# EAGLE design battery_board (EAGLE 9.6.2)
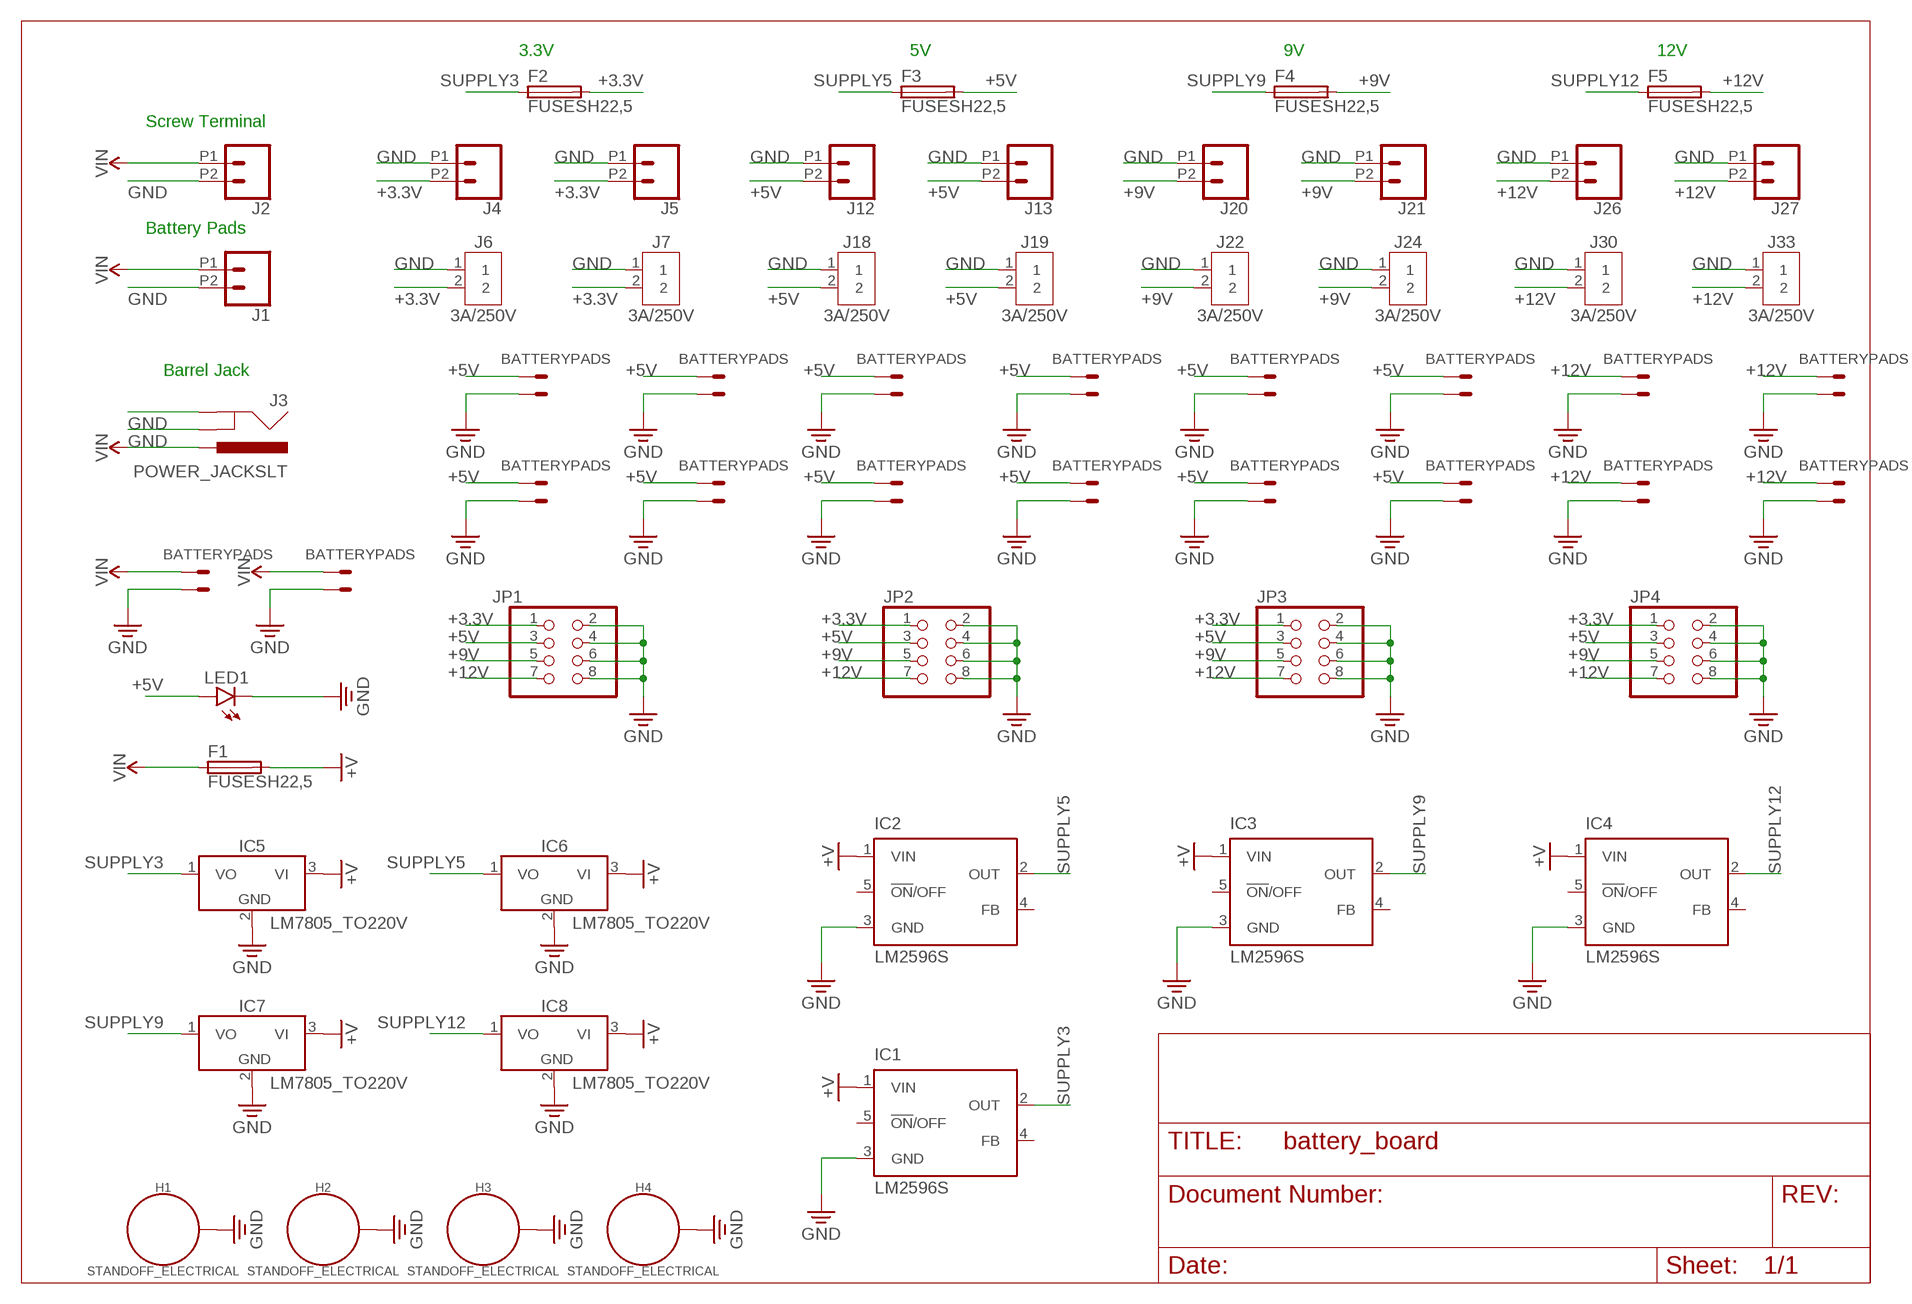
[diagram p0: schematic, sheet 1]

## Parts
BATTERY1  BATTERYPADS  [DIODFN1228X508X30-2N]
BATTERY2  BATTERYPADS  [DIODFN1228X508X30-2N]
F1  FUSESH22,5  [SH22,5]
F2  FUSESH22,5  [SH22,5]
F3  FUSESH22,5  [SH22,5]
F4  FUSESH22,5  [SH22,5]
F5  FUSESH22,5  [SH22,5]
H1  STANDOFF_ELECTRICAL  [STANDOFF-ELECTRICAL]
H2  STANDOFF_ELECTRICAL  [STANDOFF-ELECTRICAL]
H3  STANDOFF_ELECTRICAL  [STANDOFF-ELECTRICAL]
H4  STANDOFF_ELECTRICAL  [STANDOFF-ELECTRICAL]
IC1  LM2596S  [TO263-5]
IC2  LM2596S  [TO263-5]
IC3  LM2596S  [TO263-5]
IC4  LM2596S  [TO263-5]
IC5  LM7805_TO220V  [TO220V]
IC6  LM7805_TO220V  [TO220V]
IC7  LM7805_TO220V  [TO220V]
IC8  LM7805_TO220V  [TO220V]
J1  CONN_022.54MM_SCREWTERM  [1X02_2.54_SCREWTERM]
J2  CONN_022.54MM_SCREWTERM  [1X02_2.54_SCREWTERM]
J3  POWER_JACKSLT  [POWER_JACK_SLOT]
J4  CONN_022.54MM_SCREWTERM  [1X02_2.54_SCREWTERM]
J5  CONN_022.54MM_SCREWTERM  [1X02_2.54_SCREWTERM]
J6  3A/250V  B2B-XH-A  [B2B-XH-A]
J7  3A/250V  B2B-XH-A  [B2B-XH-A]
J12  CONN_022.54MM_SCREWTERM  [1X02_2.54_SCREWTERM]
J13  CONN_022.54MM_SCREWTERM  [1X02_2.54_SCREWTERM]
J18  3A/250V  B2B-XH-A  [B2B-XH-A]
J19  3A/250V  B2B-XH-A  [B2B-XH-A]
J20  CONN_022.54MM_SCREWTERM  [1X02_2.54_SCREWTERM]
J21  CONN_022.54MM_SCREWTERM  [1X02_2.54_SCREWTERM]
J22  3A/250V  B2B-XH-A  [B2B-XH-A]
J24  3A/250V  B2B-XH-A  [B2B-XH-A]
J26  CONN_022.54MM_SCREWTERM  [1X02_2.54_SCREWTERM]
J27  CONN_022.54MM_SCREWTERM  [1X02_2.54_SCREWTERM]
J30  3A/250V  B2B-XH-A  [B2B-XH-A]
J33  3A/250V  B2B-XH-A  [B2B-XH-A]
JP1  PINHD-2X4  [2X04]
JP2  PINHD-2X4  [2X04]
JP3  PINHD-2X4  [2X04]
JP4  PINHD-2X4  [2X04]
LED1  LEDCHIP-LED0805  [CHIP-LED0805]
U$1  BATTERYPADS  [DIODFN1228X508X30-2N]
U$2  BATTERYPADS  [DIODFN1228X508X30-2N]
U$3  BATTERYPADS  [DIODFN1228X508X30-2N]
U$4  BATTERYPADS  [DIODFN1228X508X30-2N]
U$5  BATTERYPADS  [DIODFN1228X508X30-2N]
U$6  BATTERYPADS  [DIODFN1228X508X30-2N]
U$7  BATTERYPADS  [DIODFN1228X508X30-2N]
U$8  BATTERYPADS  [DIODFN1228X508X30-2N]
U$9  BATTERYPADS  [DIODFN1228X508X30-2N]
U$10  BATTERYPADS  [DIODFN1228X508X30-2N]
U$11  BATTERYPADS  [DIODFN1228X508X30-2N]
U$12  BATTERYPADS  [DIODFN1228X508X30-2N]
U$13  BATTERYPADS  [DIODFN1228X508X30-2N]
U$14  BATTERYPADS  [DIODFN1228X508X30-2N]
U$15  BATTERYPADS  [DIODFN1228X508X30-2N]
U$16  BATTERYPADS  [DIODFN1228X508X30-2N]

## Nets
+3.3V: F2.2 J4.P2 J5.P2 J6.2 J7.2 JP1.1 JP2.1 JP3.1 JP4.1
+5V: F3.2 J12.P2 J13.P2 J18.2 J19.2 JP1.3 JP2.3 JP3.3 JP4.3 LED1.A U$1.VIN U$2.VIN U$3.VIN U$4.VIN U$5.VIN U$6.VIN U$7.VIN U$8.VIN U$13.VIN U$14.VIN U$15.VIN U$16.VIN
+9V: F4.2 J20.P2 J21.P2 J22.2 J24.2 JP1.5 JP2.5 JP3.5 JP4.5
+12V: F5.2 J26.P2 J27.P2 J30.2 J33.2 JP1.7 JP2.7 JP3.7 JP4.7 U$9.VIN U$10.VIN U$11.VIN U$12.VIN
+V: F1.2 IC1.1(VIN) IC2.1(VIN) IC3.1(VIN) IC4.1(VIN) IC5.3(VI) IC6.3(VI) IC7.3(VI) IC8.3(VI)
GND: BATTERY1.GND BATTERY2.GND H1.P1 H2.P1 H3.P1 H4.P1 IC1.3(GND) IC2.3(GND) IC3.3(GND) IC4.3(GND) IC5.2(GND) IC6.2(GND) IC7.2(GND) IC8.2(GND) J1.P2 J2.P2 J3.GND@1(GNDBREAK) J3.GND@2(GND) J4.P1 J5.P1 J6.1 J7.1 J12.P1 J13.P1 J18.1 J19.1 J20.P1 J21.P1 J22.1 J24.1 J26.P1 J27.P1 J30.1 J33.1 JP1.2 JP1.4 JP1.6 JP1.8 JP2.2 JP2.4 JP2.6 JP2.8 JP3.2 JP3.4 JP3.6 JP3.8 JP4.2 JP4.4 JP4.6 JP4.8 LED1.C U$1.GND U$2.GND U$3.GND U$4.GND U$5.GND U$6.GND U$7.GND U$8.GND U$9.GND U$10.GND U$11.GND U$12.GND U$13.GND U$14.GND U$15.GND U$16.GND
SUPPLY3: F2.1 IC1.2(OUT) IC5.1(VO)
SUPPLY5: F3.1 IC2.2(OUT) IC6.1(VO)
SUPPLY9: F4.1 IC3.2(OUT) IC7.1(VO)
SUPPLY12: F5.1 IC4.2(OUT) IC8.1(VO)
VIN: BATTERY1.VIN BATTERY2.VIN F1.1 J1.P1 J2.P1 J3.PWR
Unconnected: IC1.4(FB) IC1.5(!ON!/OFF) IC2.4(FB) IC2.5(!ON!/OFF) IC3.4(FB) IC3.5(!ON!/OFF) IC4.4(FB) IC4.5(!ON!/OFF)

## Notes on the sheet
- 3.3V | 5V | 9V | 12V
- Screw Terminal
- Battery Pads
- Barrel Jack

## Library data of the parts
BATTERY1 BATTERY2 U$1-U$16 = Quynn:BATTERYPADS
F1-F5 = fuse:FUSE: Fuse; OC_FARNELL: unknown; OC_NEWARK: unknown
H1-H4 = SparkFun-Hardware:STANDOFF_ELECTRICAL: Stand Off Drill holes with an electrical connection. For example, use these to ground your board to a chassis. Example SparkFun Products Screw - Phillips Head (1/4", 4-40, 10 pack) <https://www.sparkfun.com/products/10453> (PRT-10453) Screw - Phillips Head (1/2", 4-40, 10 pack) <https://www.sparkfun.com/products/10452> (PRT-10452) Screw - Phillips Head (3/4", 4-40, 10 pack) <https://www.sparkfun.com/products/10451> (PRT-10451) Screw - Phillips Head (1", 4-40, 10 pack) <https://www.sparkfun.com/products/10450> (PRT-10450)
IC1-IC4 = national-semiconductor:LM2596: SIMPLE SWITCHER® Power Converter 150 kHz 3A Step-Down Voltage Regulator Source: http://www.national.com/ds/LM/LM2596.pdf; MF: NATIONAL SEMICONDUCTOR; MPN: LM2596S-ADJ/NOPB; OC_FARNELL: 9494367; OC_NEWARK: 41K3842
IC5-IC8 = IC_Power-Management:LM7805: 5V Voltage Regulator Reference Datasheet <https://www.ti.com/lit/ds/symlink/lm340.pdf>; CATEGORY: IC_Linear; DESCRIPTION: 5V Voltage Regulator; MANUFACTURER: Generic; MPN: Generic; SERIES: LM7805; SUB-CATEGORY: Voltage Regulator; TYPE: 5V
J1 J2 J4 J5 J12 J13 J20 J21 J26 J27 = SparkFun-Connectors:CONN_02: Multi connection point. Often used as Generic Header-pin footprint for 0.1 inch spaced/style header connections On any of the 0.1 inch spaced packages, you can populate with these: Break Away Headers - Straight <https://www.sparkfun.com/products/116> (PRT-00116) Break Away Male Headers - Right Angle <https://www.sparkfun.com/products/553> (PRT-00553) Female Headers <https://www.sparkfun.com/products/115> (PRT-00115) Break Away Headers - Machine Pin <https://www.sparkfun.com/products/117> (PRT-00117) Break Away Female Headers - Swiss Machine Pin <https://www.sparkfun.com/products/743> (PRT-00743) For SCREWTERMINALS and SPRING TERMINALS visit here: Screw Terimnals on SparkFun.com <https://www.sparkfun.com/search/results?term=Screw+Terminals> (5mm/3.5mm/2.54mm spacing) This device is also useful as a general connection point to wire up your design to another part of your project. Our various solder wires solder well into these plated through hole pads. Hook-Up Wire - Assortment (Stranded, 22 AWG) <https://www.sparkfun.com/products/11375> (PRT-11375) Hook-Up Wire - Assortment (Solid Core, 22 AWG) <https://www.sparkfun.com/products/11367> (PRT-11367) View the entire wire category on our website here <https://www.sparkfun.com/categories/141> Special notes: Molex polarized connector foot print use with: PRT-08233 with associated crimp pins and housings. 2.54_SCREWTERM for use with PRT-10571. 3.5mm Screw Terminal footprints for PRT-08084 5mm Screw Terminal footprints for use with PRT-08432
J3 = SparkFun-Connectors:POWER_JACK: Power Jack Connector This is the standard 5.5mm barrel jack for power. The PTH is the most common, proven, reliable, footprint. The Slot footprint only works if the mill layer is transmitted to the PCB fab house so be warned. Here are the connectors we sell at SparkFun: DC Barrel Power Jack/Connector <https://www.sparkfun.com/products/119> (PRT-00119) DC Barrel Power Jack/Connector (SMD) <https://www.sparkfun.com/products/12748> (PRT-12748) DC Barrel Jack Adapter - Breadboard Compatible <https://www.sparkfun.com/products/10811> (PRT-10811) It is used on this SparkFun product (and many, many others): SparkFun RedBoard - Programmed with Arduino <https://www.sparkfun.com/products/12757> (DEV-12757) Also, if you need a mating power supply or connector, please check these out: Wall Adapter Power Supply - 9VDC 650mA <https://www.sparkfun.com/products/298> (TOL-00298) DC Barrel Jack Adapter - Male <https://www.sparkfun.com/products/10287> (PRT-10287); PROD_ID: PRT-00119
J6 J7 J18 J19 J22 J24 J30 J33 = Connector:B2B-XH-A: XH Connector Top Entry - 2POS Details see: Datasheet <http://www.jst-mfg.com/product/pdf/eng/eXH.pdf>; CATEGORY: CONNECTOR; DESCRIPTION: 2.5mm pitch/disconnectable crimp style connector; MANUFACTURER: JST (XH CONNECTOR); MPN: B2B-XH-A; OPERATING_TEMPERATURE: -25°C ~ 85°C; PART_STATUS: ACTIVE; ROHS_COMPLIANT: COMPLIANT; SERIES: B_B-XH-A; SUB_CATEGORY: Through hole connector; TYPE: top entry
JP1-JP4 = adafruit:PINHD-2X4: PIN HEADER
LED1 = led:LED: LED OSRAM: - CHIPLED LG R971, LG N971, LY N971, LG Q971, LY Q971, LO R971, LY R971 LH N974, LH R974 LS Q976, LO Q976, LY Q976 LO Q996 - Hyper CHIPLED LW Q18S LB Q993, LB Q99A, LB R99A - SideLED LS A670, LO A670, LY A670, LG A670, LP A670 LB A673, LV A673, LT A673, LW A673 LH A674 LY A675 LS A676, LA A676, LO A676, LY A676, LW A676 LS A679, LY A679, LG A679 - Hyper Micro SIDELED® LS Y876, LA Y876, LO Y876, LY Y876 LT Y87S - SmartLED LW L88C, LW L88S LB L89C, LB L89S, LG L890 LS L89K, LO L89K, LY L89K LS L896, LA L896, LO L896, LY L896 - TOPLED LS T670, LO T670, LY T670, LG T670, LP T670 LSG T670, LSP T670, LSY T670, LOP T670, LYG T670 LG T671, LOG T671, LSG T671 LB T673, LV T673, LT T673, LW T673 LH T674 LS T676, LA T676, LO T676, LY T676, LB T676, LH T676, LSB T676, LW T676 LB T67C, LV T67C, LT T67C, LS T67K, LO T67K, LY T67K, LW E67C LS E67B, LA E67B, LO E67B, LY E67B, LB E67C, LV E67C, LT E67C LW T67C LS T679, LY T679, LG T679 LS T770, LO T770, LY T770, LG T770, LP T770 LB T773, LV T773, LT T773, LW T773 LH T774 LS E675, LA E675, LY E675, LS T675 LS T776, LA T776, LO T776, LY T776, LB T776 LHGB T686 LT T68C, LB T68C - Hyper Mini TOPLED® LB M676 - Mini TOPLED Santana® LG M470 LS M47K, LO M47K, LY M47K Source: http://www.osram.convergy.de LUXEON: - LUMILED® LXK2-PW12-R00, LXK2-PW12-S00, LXK2-PW14-U00, LXK2-PW14-V00 LXK2-PM12-R00, LXK2-PM12-S00, LXK2-PM14-U00 LXK2-PE12-Q00, LXK2-PE12-R00, LXK2-PE12-S00, LXK2-PE14-T00, LXK2-PE14-U00 LXK2-PB12-K00, LXK2-PB12-L00, LXK2-PB12-M00, LXK2-PB14-N00, LXK2-PB14-P00, LXK2-PB14-Q00 LXK2-PR12-L00, LXK2-PR12-M00, LXK2-PR14-Q00, LXK2-PR14-R00 LXK2-PD12-Q00, LXK2-PD12-R00, LXK2-PD12-S00 LXK2-PH12-R00, LXK2-PH12-S00 LXK2-PL12-P00, LXK2-PL12-Q00, LXK2-PL12-R00 Source: www.luxeon.com KINGBRIGHT: KA-3528ASYC Source: www.kingbright.com

## Board
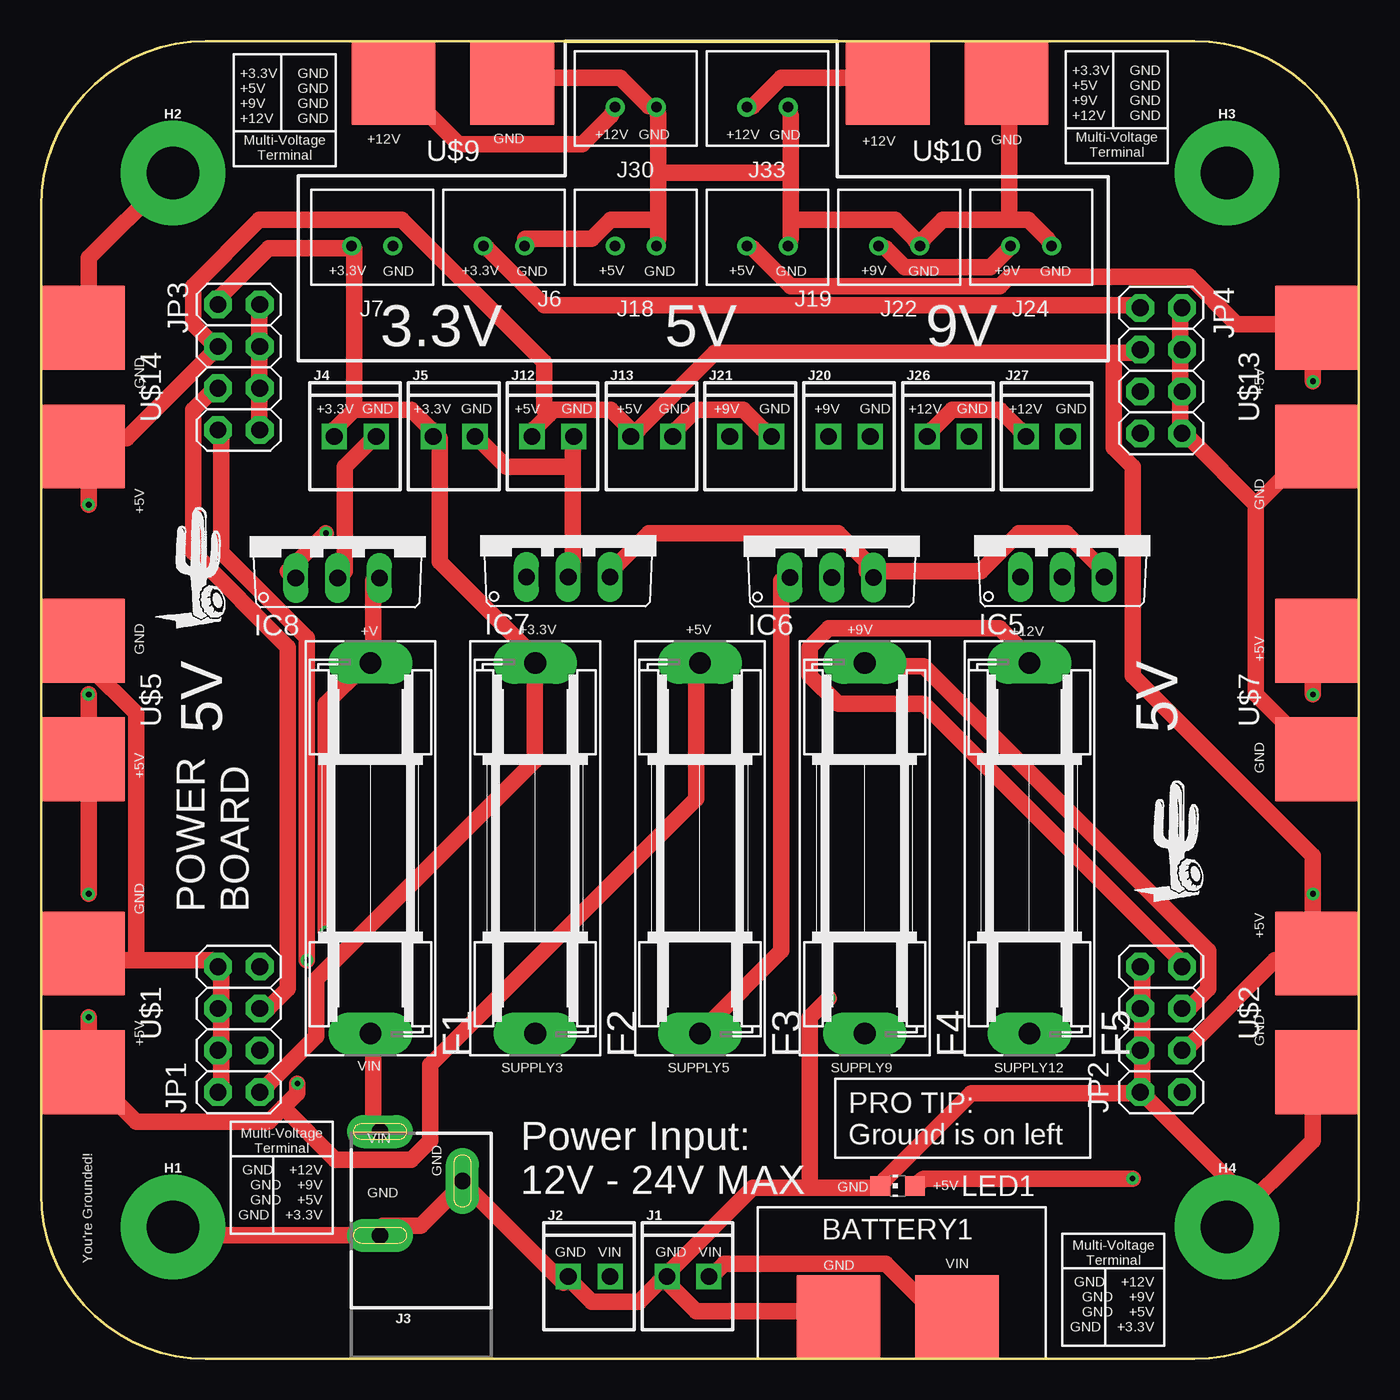
[diagram p1: board, top side]
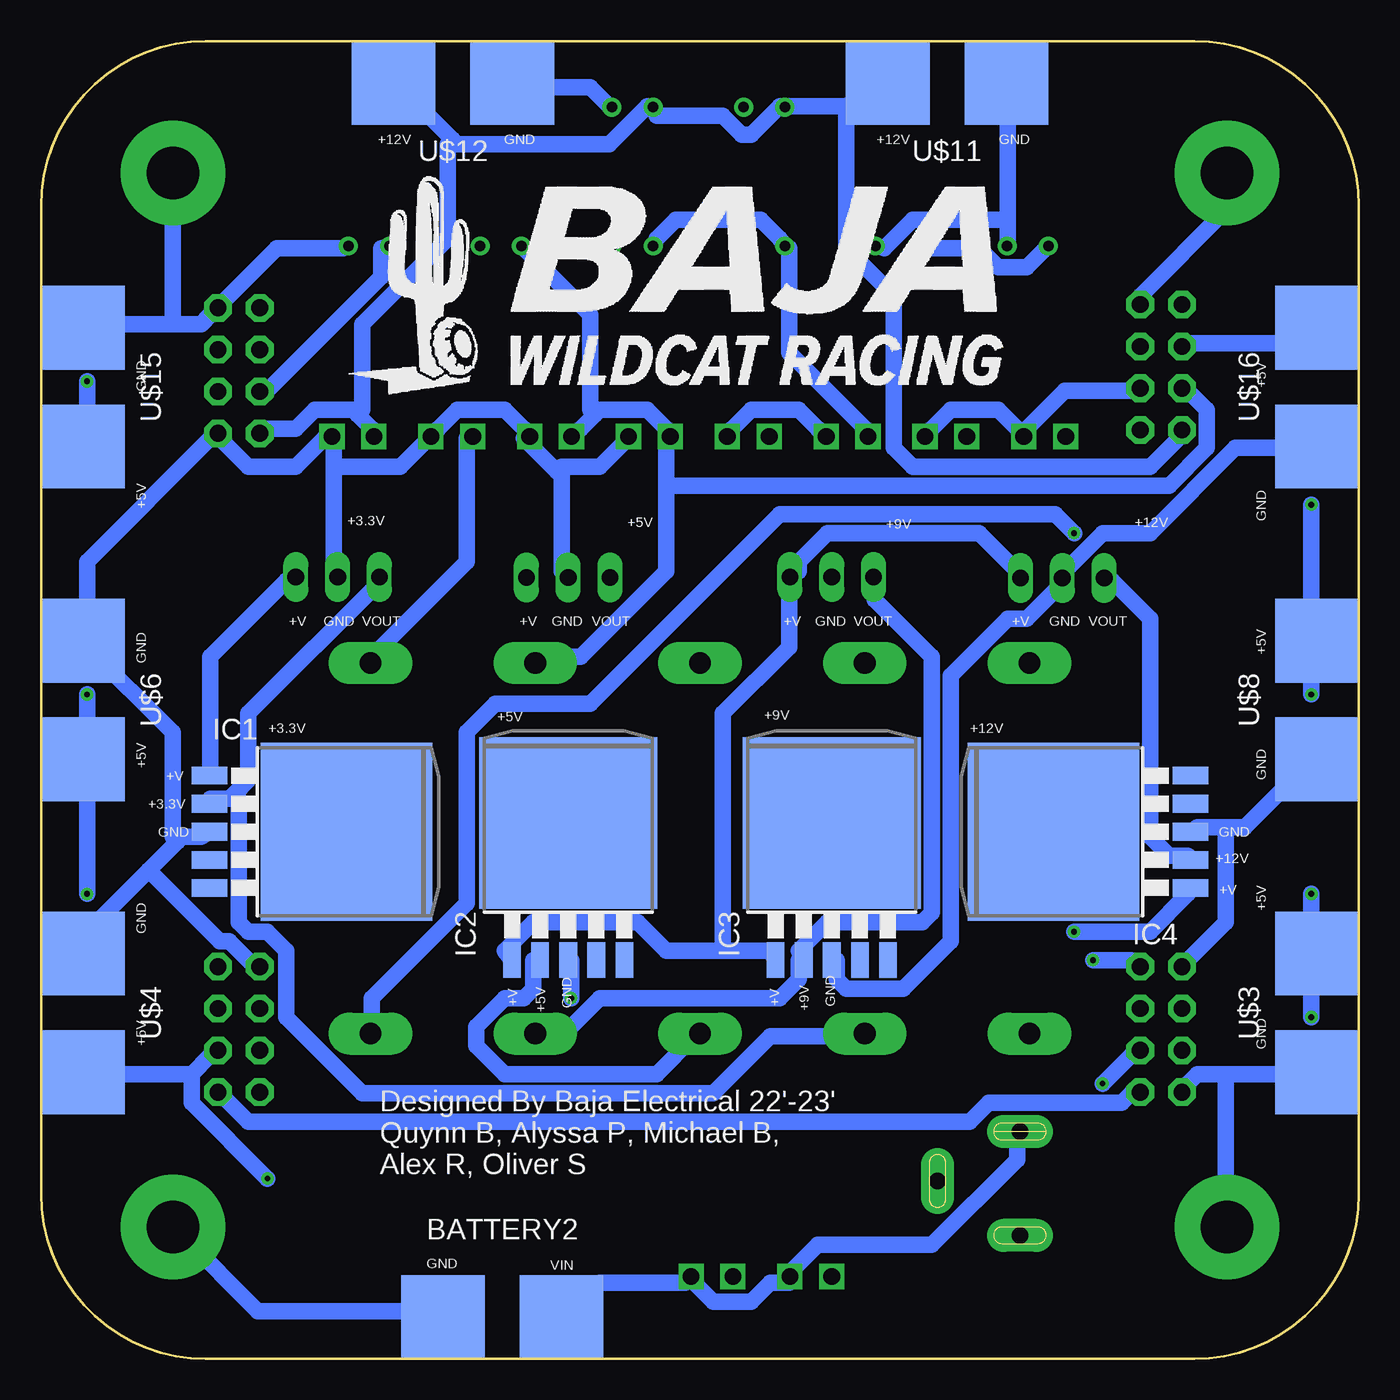
[diagram p2: board, bottom side, seen from below]

Size 80 x 80 mm. Coordinates in mm from the lower left corner, seen from the top.
Outline: 10,0 arc-90 0,10 0,70 arc-90 10,80 70,80 arc-90 80,70 80,10 arc-90 70,0 10,0
Copper layers (1*16): Top 0.035mm / dielectric 1.5mm / Bottom 0.035mm
Design rules "default *": minimum track width 1mm, minimum drill 0.35mm, track to track 6mil, track to pad 6mil, pad to pad 6mil, via to via 6mil, smd to smd 6mil, copper to edge 40mil, drill to drill 6mil, minimum pad ring 10mil, minimum via ring 8mil, stop-mask expansion 4mil, vias tented up to drill 0mil, thermal gap 10mil

### Footprints (pad centres in the part's own frame; a part is rotated, then mirrored left to right if it is on the bottom)
DIODFN1228X508X30-2N = smd 5.08 x 5.08: GND -3.6,2.54; VIN 3.6,2.54
SH22,5 = drill 1.321 pad 2.54 long: 1 -11.252,0; 2 11.252,0
STANDOFF-ELECTRICAL = drill 3.2 pad 6.35: P1 0,0
TO263-5 = smd 1.067 x 2.159: 1 -3.404,-5.791; 2 -1.702,-5.791; 3 0,-5.791; 4 1.702,-5.791; 5 3.404,-5.791 | smd 10.8 x 10.41: 6 0,2.54
TO220V = drill 1.016 long: 1 -2.54,-2.54; 2 0,-2.54; 3 2.54,-2.54
1X02_2.54_SCREWTERM = drill 1.016 square: P1 2.54,0; P2 0,0
POWER_JACK_SLOT = drill 1 pad 2 long: GND@1 2.58,7.5; GND@2 7.58,10.8; PWR 2.58,13.8
B2B-XH-A = drill 0.64: 1 0,0; 2 2.5,0
2X04 = drill 1.016 pad 1.676 octagon: 1 -3.81,-1.27; 2 -3.81,1.27; 3 -1.27,-1.27; 4 -1.27,1.27; 5 1.27,-1.27; 6 1.27,1.27; 7 3.81,-1.27; 8 3.81,1.27
CHIP-LED0805 = smd 1.2 x 1.2: A 0,-1.05; C 0,1.05

### Placement (x,y rotation side)
BATTERY1  52,0 0 top
BATTERY2  52,0 0 bottom
F1  20,31 90 top
F2  30,31 90 top
F3  40,31 90 top
F4  50,31 90 top
F5  60,31 90 top
H1  8,8 0 top
H2  8,72 0 top
H3  72,72 0 top
H4  72,8 0 top
IC1  64,32 270 bottom
IC2  48,30 0 bottom
IC3  32,30 0 bottom
IC4  16,32 90 bottom
IC5  62,50 0 top
IC6  48,49.98 0 top
IC7  32,50 0 top
IC8  18,49.95 0 top
J1  38,5 0 top
J2  32,5 0 top
J3  18,0 0 top
J4  17.8,56 0 top
J5  23.8,56 0 top
J6  29.35,67.56 180 top
J7  21.35,67.56 180 top
J12  29.8,56 0 top
J13  35.8,56 0 top
J18  37.35,67.56 180 top
J19  45.35,67.56 180 top
J20  47.8,56 0 top
J21  41.8,56 0 top
J22  53.35,67.56 180 top
J24  61.35,67.56 180 top
J26  53.8,56 0 top
J27  59.8,56 0 top
J30  37.35,76 180 top
J33  45.35,76 180 top
JP1  12,20 90 top
JP2  68,20 90 top
JP3  12,60.2 270 top
JP4  68,60 270 top
LED1  52,10.5 90 top
U$1  0,21 270 top
U$2  80,21 90 top
U$3  0,21 90 bottom
U$4  80,21 270 bottom
U$5  0,40 270 top
U$6  80,40 270 bottom
U$7  80,40 90 top
U$8  0,40 90 bottom
U$9  25,80 180 top
U$10  55,80 180 top
U$11  25,80 180 bottom
U$12  55,80 180 bottom
U$13  80,59 90 top
U$14  0,59 270 top
U$15  80,59 270 bottom
U$16  0,59 90 bottom

### Tracks (layer width: path | path; a pad name or v marks a point on that pad's centre or on a via)
+3.3V
  Top 1: 19.02,57.62 17.86,56.47 J4.P2 | 19.02,57.62 22.47,57.62 23.62,56.47 J5.P2 24.2,55.89 24.2,48.4 29.96,42.64 F2.2 29.96,42.06 29.96,36.3 16.71,23.05 16.71,19.59 13.83,16.71 JP1.1 | JP3.1 10.95,64.53 13.83,67.42 18.44,67.42 J7.2 19.02,67.42 19.02,57.62 | JP4.1 66.26,63.96 30.54,63.96 27.08,67.42 J6.2
  Bottom 1: J6.2 26.5,67.42 23.05,67.42 21.9,66.26 20.17,66.26 19.02,67.42 J7.2 | JP2.1 69.14,16.13 67.42,14.4 23.62,14.4 22.47,15.56 14.4,15.56 13.83,16.13 JP1.1
+5V  (via drill 0.35)
  Top 1: v2.88,40.33 2.88,36.88 U$5.VIN 2.88,36.3 v2.88,28.23 | v15.56,16.71 15.56,16.13 14.69,15.27 | 14.69,15.27 13.83,14.4 5.76,14.4 2.88,17.29 U$1.VIN 2.88,17.86 v2.88,20.74 | 14.69,15.27 17.86,12.1 22.47,12.1 23.62,13.25 23.62,17.86 39.76,34 39.76,42.06 F3.2 | v77.21,40.33 77.21,43.22 U$7.VIN | v66.26,10.95 53.59,10.95 LED1.A | JP2.3 69.72,19.02 74.91,24.2 77.21,24.2 U$2.VIN 77.21,24.78 v77.21,28.23 77.21,30.54 66.26,41.49 66.26,54.16 65.11,55.31 65.11,61.08 | v77.21,59.35 77.21,62.23 U$13.VIN 77.21,62.81 72.6,62.81 69.72,65.69 58.77,65.69 58.2,65.11 45.52,65.11 43.22,67.42 J19.2 | 30.83,57.33 31.11,57.62 34.57,57.62 35.72,56.47 J13.P2 36.3,56.47 40.91,61.08 65.11,61.08 | 30.83,57.33 29.96,56.47 J12.P2 | 65.11,61.08 66.26,61.08 JP4.3 | 30.83,57.33 30.54,57.62 30.54,60.5 21.9,69.14 13.25,69.14 9.22,65.11 9.22,62.81 10.37,61.65 JP3.3 10.37,61.08 5.19,55.89 2.88,55.89 U$14.VIN 2.88,55.31 v2.88,51.86
  Bottom 1: v2.88,40.33 2.88,43.22 U$8.VIN 2.88,43.79 v2.88,51.86 | v15.56,16.71 13.83,18.44 JP1.3 | v2.88,20.74 2.88,24.2 U$3.VIN 2.88,24.78 v2.88,28.23 | v77.21,40.33 77.21,36.88 U$6.VIN 77.21,36.3 v77.21,28.23 | v66.26,10.95 70.87,15.56 70.87,17.29 | 70.87,17.29 69.72,18.44 JP2.3 | 70.87,17.29 77.21,17.29 U$4.VIN | JP3.3 10.37,61.65 3.46,61.65 2.88,62.23 U$16.VIN | v77.21,59.35 77.21,55.89 U$15.VIN | J19.2 42.64,67.99 41.49,69.14 36.3,69.14 35.15,67.99 J18.2 34.57,67.42 34.57,61.08 29.96,56.47 J12.P2
+9V
  Top 1: JP1.5 13.83,21.32 14.98,22.47 14.98,43.22 9.22,48.98 9.22,57.62 10.37,58.77 JP3.5 | J22.2 51.28,67.42 52.43,66.26 57.62,66.26 58.77,67.42 J24.2 | JP2.5 69.72,21.32 70.87,22.47 70.87,24.78 53.59,42.06 50.13,42.06 F4.2
  Bottom 1: 46.38,57.33 47.25,56.47 J20.P2 | 46.38,57.33 46.1,57.62 43.22,57.62 42.06,56.47 J21.P2 42.06,55.89 42.06,53.01 | JP4.5 66.26,58.77 59.35,65.69 59.35,67.42 J24.2 | 46.38,57.33 46.67,57.62 46.67,63.38 50.71,67.42 J22.2 | 42.06,53.01 42.06,47.83 47.25,42.64 49.55,42.64 F4.2 | 42.06,53.01 11.52,53.01 9.22,55.31 9.22,57.62 10.37,58.77 JP3.5
+12V  (via drill 0.35)
  Top 1: J26.P2 54.16,56.47 55.31,57.62 58.2,57.62 59.35,56.47 J27.P2 | JP2.7 69.14,24.2 53.59,39.76 48.4,39.76 46.67,41.49 46.67,43.22 47.83,44.37 58.2,44.37 59.92,42.64 F5.2 | J33.2 43.22,76.06 44.94,77.79 51.28,77.79 U$10.VIN | v16.13,24.2 16.13,43.79 10.95,48.98 10.95,55.89 JP3.7 | U$9.VIN 21.9,77.21 25.35,73.75 32.84,73.75 34.57,75.48 J30.2
  Bottom 1: 60.79,57.33 59.92,56.47 J27.P2 | 60.79,57.33 61.08,57.62 63.38,57.62 64.53,56.47 66.26,56.47 JP4.7 | J26.P2 54.16,55.89 54.16,48.4 59.92,42.64 F5.2 | 55.03,74.04 54.74,73.75 45.52,73.75 43.22,76.06 J33.2 42.64,75.48 38.6,75.48 37.45,74.33 36.88,74.33 35.15,76.06 J30.2 34.57,76.06 31.11,76.06 | 55.03,74.04 58.2,77.21 U$12.VIN | 31.11,76.06 29.96,76.06 28.81,77.21 U$11.VIN 31.11,76.06 | 31.11,76.06 31.11,67.42 28.23,64.53 28.23,55.31 27.08,54.16 12.68,54.16 10.95,55.89 JP3.7 | v16.13,24.2 13.83,24.2 JP1.7 | 60.79,57.33 60.5,57.62 60.5,62.81 55.31,67.99 55.31,73.75 55.03,74.04
+V  (via drill 0.35)
  Top 1: IC5.3 64.53,47.83 62.23,50.13 59.35,50.13 57.04,47.83 50.71,47.83 IC6.3 50.13,47.83 50.13,48.4 48.4,50.13 36.88,50.13 34.57,47.83 IC7.3 | v17.29,25.93 17.29,39.76 19.59,42.06 F1.2 20.17,42.64 20.17,47.25 IC8.3
  Bottom 1: IC1.1 69.72,35.72 69.72,42.64 65.11,47.25 IC5.3 | 38.6,24.78 42.06,24.78 43.79,26.5 50.13,26.5 51.86,24.78 IC2.1 | 38.6,24.78 35.72,24.78 IC3.1 | v17.29,25.93 12.68,25.93 10.37,28.23 IC4.1 | IC8.3 20.74,47.83 23.05,50.13 32.27,50.13 34,48.4 34,47.83 IC7.3 34.57,47.25 34.57,43.22 38.6,39.18 38.6,24.78
GND  (via drill 0.35)
  Top 1: U$14.GND 2.88,62.81 2.88,66.84 7.49,71.45 H2.P1 | JP3.8 13.25,56.47 13.25,58.77 JP3.6 13.25,59.35 13.25,61.08 JP3.4 13.25,61.65 13.25,63.96 JP3.2 | 32.27,54.16 32.27,55.89 J12.P1 | 32.27,54.16 32.27,47.83 IC7.2 | 32.27,54.16 28.23,54.16 26.5,55.89 J5.P1 | J21.P1 43.79,56.47 42.64,57.62 39.76,57.62 38.6,56.47 J13.P1 | IC8.2 18.44,47.83 18.44,54.16 20.17,55.89 J4.P1 | 46.67,10.37 43.22,10.37 38.03,5.19 J1.P2 | 46.67,10.37 50.71,10.37 LED1.C 51.28,10.95 56.47,16.13 66.26,16.13 JP2.2 | v47.83,21.9 46.67,20.74 46.67,10.37 | J1.P2 37.45,4.61 36.3,3.46 33.42,3.46 32.27,4.61 J2.P2 31.69,4.61 25.93,10.37 J3.GND@2 25.35,10.37 23.05,8.07 20.74,8.07 J3.GND@1 20.17,7.49 8.07,7.49 H1.P1 | BATTERY1.GND 47.83,2.88 39.76,2.88 38.03,4.61 J1.P2 | JP1.2 10.95,16.71 10.95,18.44 JP1.4 10.95,19.02 10.95,20.74 JP1.6 10.95,21.32 10.95,23.62 JP1.8 10.37,24.2 5.76,24.2 | 5.76,24.2 2.88,24.2 U$1.GND | 5.76,24.2 5.76,39.18 2.88,42.06 2.88,43.22 U$5.GND | JP2.2 66.84,16.71 66.84,18.44 JP2.4 66.84,19.02 66.84,20.74 JP2.6 66.84,21.32 66.84,23.62 JP2.8 | U$2.GND 77.21,17.29 77.21,13.25 72.03,8.07 H4.P1 73.18,9.79 66.84,16.13 JP2.2 | 45.52,72.03 45.52,75.48 J33.1 | 45.52,72.03 45.52,69.14 | 45.52,69.14 45.52,67.99 J19.1 | 45.52,69.14 51.86,69.14 53.01,67.99 J22.1 53.59,67.99 54.74,69.14 58.77,69.14 | 58.77,69.14 59.92,69.14 61.08,67.99 J24.1 | 58.77,69.14 58.77,77.21 U$10.GND | 37.45,72.03 37.45,75.48 J30.1 36.88,76.06 35.15,77.79 28.81,77.79 U$9.GND | 37.45,72.03 37.45,69.14 | 37.45,69.14 37.45,67.99 J18.1 | 37.45,69.14 34.57,69.14 33.42,67.99 29.39,67.99 J6.1 | 37.45,72.03 45.52,72.03 | JP4.2 69.14,63.38 69.14,61.65 JP4.4 69.14,61.08 69.14,58.77 JP4.6 69.14,58.2 69.14,56.47 JP4.8 69.72,55.89 73.75,51.86
  Top 1: 73.75,51.86 73.75,40.33 77.21,36.88 U$7.GND | 73.75,51.86 77.21,55.31 U$13.GND
  Bottom 1: IC3.3 31.69,24.2 31.69,23.05 31.11,22.47 27.66,22.47 24.78,25.35 24.78,41.49 21.32,44.94 20.17,44.94 17.86,47.25 IC8.2 17.86,47.83 15.56,50.13 12.68,50.13 7.49,55.31 2.88,55.31 U$16.GND | 62.23,54.16 62.23,55.89 J27.P1 62.81,55.89 64.53,54.16 67.42,54.16 69.14,55.89 JP4.8 69.72,55.89 77.21,48.4 77.21,43.79 U$6.GND 77.21,43.22 72.03,38.03 72.03,31.69 71.74,31.4 | 62.23,54.16 62.23,47.83 IC5.2 | 62.23,54.16 58.2,54.16 56.47,55.89 J26.P1 55.89,56.47 54.74,57.62 51.86,57.62 50.71,56.47 J20.P1 50.71,55.89 48.69,53.88 | 48.69,53.88 48.4,53.59 48.4,47.83 IC6.2 | J21.P1 44.37,55.89 46.1,54.16 48.4,54.16 48.69,53.88 | J5.P1 25.93,56.47 24.78,57.62 21.9,57.62 20.74,56.47 J4.P1 20.17,56.47 17.86,58.77 13.83,58.77 JP3.6 | J13.P1 38.03,56.47 36.88,57.62 34,57.62 32.84,56.47 J12.P1 | H2.P1 8.07,71.45 8.07,69.72 13.25,64.53 JP3.2 | v47.83,21.9 47.83,24.2 IC2.3 | 8.07,32.27 6.91,32.27 2.88,36.3 U$8.GND | 8.07,32.27 9.79,32.27 IC4.3 | 8.07,17.29 9.79,17.29 10.37,16.71 JP1.2 | 8.07,17.29 2.88,17.29 U$3.GND | 8.07,32.27 8.07,26.5 10.37,24.2 JP1.8 | 8.07,17.29 8.07,8.07 H1.P1 | 73.47,29.67 77.21,25.93 77.21,24.78 U$4.GND | 73.47,29.67 71.74,31.4 | 71.74,31.4 71.45,31.69 70.3,31.69 IC1.3 | BATTERY2.GND 55.89,2.88 66.84,2.88 71.45,7.49 H4.P1 | 73.47,29.67 69.14,25.35 68.57,25.35 66.84,23.62 JP2.8 | U$12.GND 51.28,77.21 46.67,77.21 45.52,76.06 J33.1 | 21.32,69.14 21.32,77.21 U$11.GND | 21.32,69.14 21.32,67.99 J7.1 | 21.32,69.14 27.08,69.14 28.81,67.42 J6.1 | 72.03,62.81 70.3,62.81 69.72,63.38 JP4.2 69.14,63.96 65.69,67.42 61.65,67.42 J24.1 | 72.03,62.81 77.21,62.81 U$15.GND | 72.03,62.81 72.03,71.45 H3.P1
SUPPLY3
  Bottom 1: 68.28,34.28 67.42,35.15 67.42,39.18 59.35,47.25 IC5.1 | 68.28,34.28 68.57,34 69.72,34 IC1.2 | F2.1 30.54,19.59 35.72,19.59 39.18,16.13 60.5,16.13 65.11,20.74 65.11,24.78 66.26,25.93 67.42,25.93 67.99,26.5 67.99,34 68.28,34.28
SUPPLY5
  Top 1: IC6.1 44.94,47.25 44.94,24.78 40.33,20.17 F3.1
  Bottom 1: IC2.2 50.13,24.2 50.13,22.47 50.71,21.9 51.86,21.9 53.59,20.17 53.59,19.02 51.86,17.29 42.64,17.29 40.33,19.59 F3.1
SUPPLY9
  Bottom 1: F4.1 49.55,20.17 47.83,20.17 46.1,21.9 35.15,21.9 34,23.05 34,24.2 IC3.2 34,24.78 32.27,26.5 26.5,26.5 25.93,27.08 25.93,42.64 29.39,46.1 29.39,47.25 IC7.1
SUPPLY12  (via drill 0.35)
  Top 1: v17.29,50.13 14.98,47.83 IC8.1
  Bottom 1: IC4.2 10.37,30.54 11.52,30.54 12.68,31.69 12.68,44.94 14.98,47.25 IC8.1 | v17.29,50.13 18.44,51.28 35.15,51.28 46.67,39.76 52.43,39.76 54.16,38.03 54.16,27.66 59.92,21.9 59.92,20.17 F5.1
VIN
  Top 1: J3.PWR 20.17,13.83 20.17,19.59 F1.1 | BATTERY1.VIN 55.31,2.88 54.16,2.88 51.28,5.76 41.49,5.76 40.91,5.19 J1.P1
  Bottom 1: BATTERY2.VIN 47.83,2.88 46.1,4.61 40.91,4.61 J1.P1 40.33,4.61 39.18,3.46 36.88,3.46 35.72,4.61 34.57,4.61 J2.P1 34.57,5.19 32.84,6.91 25.93,6.91 20.74,12.1 20.74,13.25 J3.PWR

### Text on the board
tNames: +3.3V GND / +5V GND / +9V GND / +12V GND | +12V | GND | +12V | GND | +3.3V GND / +5V GND / +9V GND / +12V GND | Multi-Voltage / Terminal | +12V | GND | +12V | GND | Multi-Voltage / Terminal | +3.3V | GND | +3.3V | GND | +5V | GND | +5V | GND | +9V | GND | +9V | GND | 3.3V | 5V | 9V | GND | +5V | +3.3V | +3.3V | +5V | +5V | +9V | +9V | +12V | +12V | GND | GND | GND | GND | GND | GND | GND | GND | GND | +5V | +3.3V | +5V | +9V | +V | +12V | GND | +5V | 5V | 5V | GND | +5V | GND | POWER / BOARD | +5V | +5V | GND | VIN | SUPPLY3 | SUPPLY5 | SUPPLY9 | SUPPLY12 | VIN | PRO TIP: / Ground is on left | Multi-Voltage / Terminal | GND +12V / GND +9V / GND +5V / GND +3.3V | GND | +5V | GND | Power Input: / 12V - 24V MAX | GND | You're Grounded! | GND | VIN | GND | VIN | VIN | Multi-Voltage / Terminal | GND | GND +12V / GND +9V / GND +5V / GND +3.3V
bNames: GND | +12V | GND | +12V | +5V | GND | GND | +5V | +3.3V | +12V | +9V | +5V | +5V | VOUT | GND | +V | VOUT | GND | +V | VOUT | GND | +V | VOUT | GND | +V | GND | +9V | +5V | +12V | +3.3V | GND | +5V | +V | +3.3V | GND | GND | +12V | +5V | +V | GND | +9V | +5V | +V | +V | GND | GND | GND | +5V | Designed By Baja Electrical 22'-23' / Quynn B, Alyssa P, Michael B, / Alex R, Oliver S | GND | VIN
200bmp: C:/Baja/Full Baja Logo - Black_flip.bmp | C:/Baja/Full Baja Logo - cactus.bmp | C:/Baja/Full Baja Logo - cactus_flip.bmp